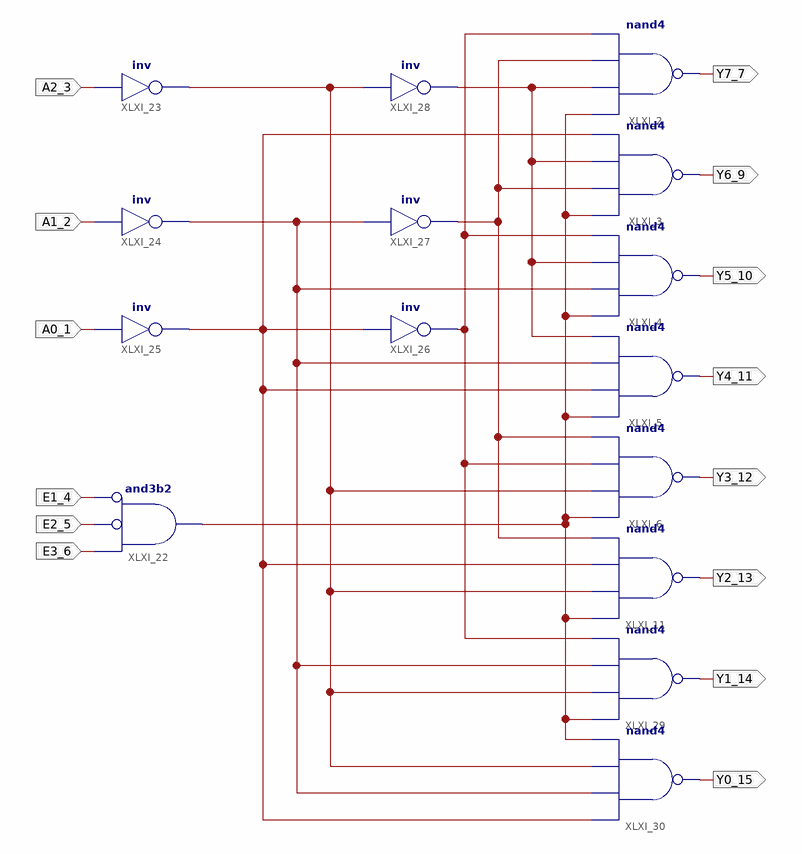
[diagram p0: schematic sheet 1]
// Xilinx ISE schematic A138.sch (spartan6) as structural Verilog: 15 symbols, 14 ports
module A138 (
  input  A0_1,
  input  A1_2,
  input  A2_3,
  input  E1_4,
  input  E2_5,
  input  E3_6,
  output Y7_7,
  output Y6_9,
  output Y5_10,
  output Y4_11,
  output Y3_12,
  output Y1_14,
  output Y2_13,
  output Y0_15
);

  wire XLXN_1, XLXN_3, XLXN_5, XLXN_7, XLXN_27, XLXN_31, XLXN_32;

  nand XLXI_2 (Y7_7, XLXN_5, XLXN_1, XLXN_7, XLXN_3);
  nand XLXI_3 (Y6_9, XLXN_5, XLXN_7, XLXN_1, XLXN_32);
  nand XLXI_4 (Y5_10, XLXN_5, XLXN_31, XLXN_1, XLXN_3);
  nand XLXI_5 (Y4_11, XLXN_5, XLXN_32, XLXN_31, XLXN_1);
  nand XLXI_6 (Y3_12, XLXN_5, XLXN_27, XLXN_3, XLXN_7);
  not XLXI_26 (XLXN_3, XLXN_32);
  not XLXI_27 (XLXN_7, XLXN_31);
  not XLXI_28 (XLXN_1, XLXN_27);
  nand XLXI_29 (Y1_14, XLXN_5, XLXN_27, XLXN_31, XLXN_3);
  nand XLXI_30 (Y0_15, XLXN_32, XLXN_31, XLXN_27, XLXN_5);
  not XLXI_23 (XLXN_27, A2_3);
  not XLXI_24 (XLXN_31, A1_2);
  not XLXI_25 (XLXN_32, A0_1);
  and XLXI_22 (XLXN_5, ~E1_4, ~E2_5, E3_6);  // and3b2
  nand XLXI_11 (Y2_13, XLXN_5, XLXN_27, XLXN_32, XLXN_7);
endmodule
